# Altium schematic sheet Current_Sensor_cct.SchDoc
size A4
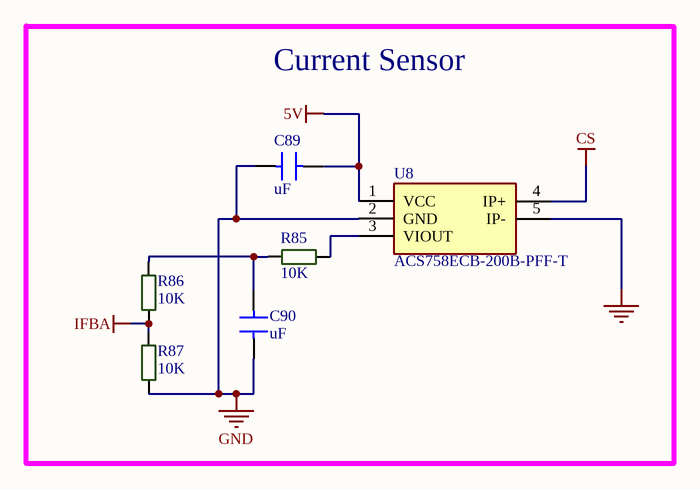
[diagram p0: Current_Sensor_cct.SchDoc]

## Parts
C89  uF  [C-1206]
C90  uF  [C-1206]
R85  10K  [R-1206]
R86  10K  [R-1206]
R87  10K  [R-1206]
U8  ACS758ECB-200B-PFF-T  [ACS756SCA-050B-PFF-T_2]

## Blocks framed on the sheet
Current Sensor: C89 C90 R85-R87 U8

## Nets
5V: C89.1 U8.1(VCC)
CS: U8.4(IP+)
GND: C89.2 C90.1 R87.2 U8.2(GND) U8.5(IP-)
IFBA: R86.2 R87.1
NetC90_2: C90.2 R85.2 R86.1
NetR85_1: R85.1 U8.3(VIOUT)

## Library data of the parts
C89 C90 = C-1206
R85-R87 = R-1206_GS: 1206S4F1002T5E; ComponentLink1Description: link; ComponentLink1URL: https://www.ozdisan.com/pasif-komponentler/direncler/smt-smd-direncler/1206S4F1002T5E
U8 = ACS758ECB-200B-PFF-T: Undefined or Miscellaneous; Manufacturer_Name: Allegro Microsystems; Datasheet Link: http://www.farnell.com/datasheets/926109.pdf; Manufacturer_Part_Number: ACS758ECB-200B-PFF-T; Arrow Part Number: ACS758ECB-200B-PFF-T; Arrow Price/Stock: https://www.arrow.com/en/products/acs758ecb-200b-pff-t/allegro-microsystems